# EAGLE design ShardV3 (EAGLE 7.3.0)
CNAME: EARS PocketQube Template; CREVISION: 1.0; DESIGNER: M. Isbell & L. Stant
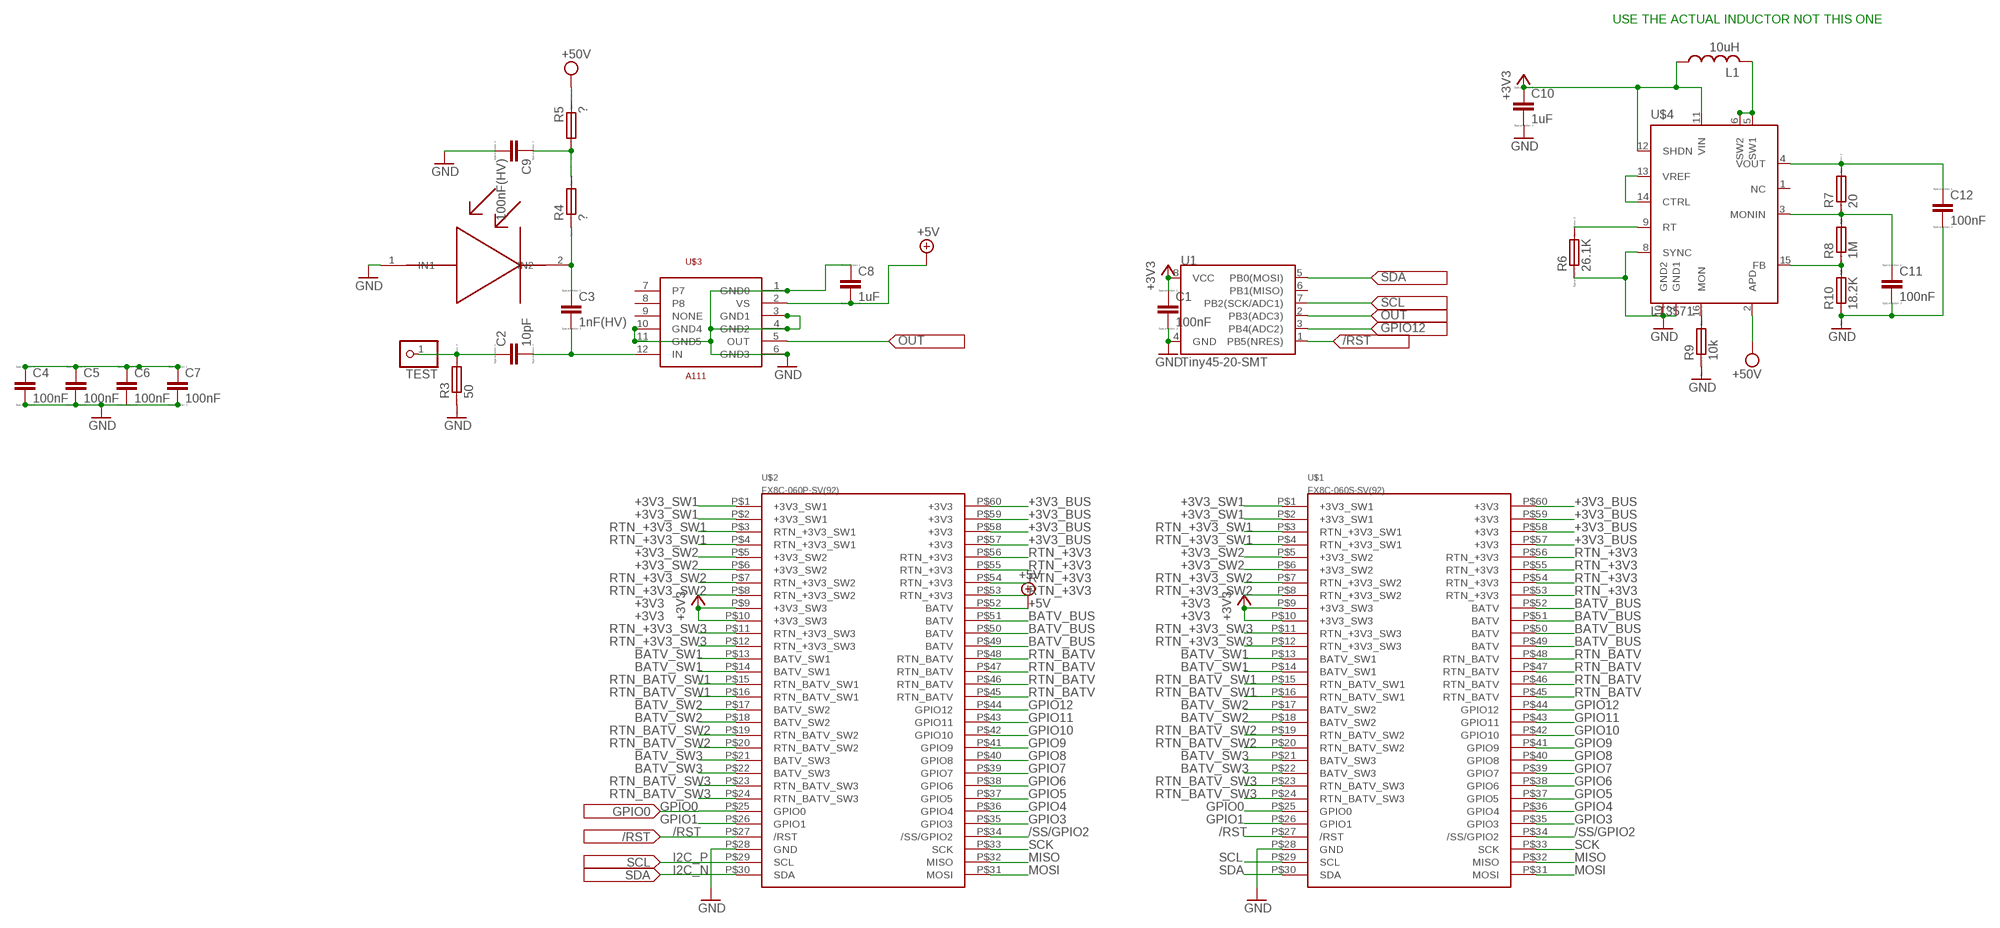
[diagram p0: schematic, sheet 1]

## Parts
C1  100nF  CC0402  [C0402]
C2  10pF  CC0402  [C0402]
C3  1nF(HV)  CC0603  [C0603]
C4  100nF  CC0402  [C0402]
C5  100nF  CC0402  [C0402]
C6  100nF  CC0402  [C0402]
C7  100nF  CC0402  [C0402]
C8  1uF  CC0603  [C0603]
C9  100nF(HV)  CC0603  [C0603]
C10  1uF  CC0603  [C0603]
C11  100nF  CC0603  [C0603]
C12  100nF  CC0603  [C0603]
L1  10uH  L-USL1812  [L1812]
NDD  S3590-08  [S3590-08]
R3  50  RR0402  [R0402]
R4  ?  RR0402  [R0402]
R5  ?  RR0402  [R0402]
R6  26.1K  RR0402  [R0402]
R7  20  RR0402  [R0402]
R8  1M  RR0402  [R0402]
R9  10k  RR0402  [R0402]
R10  18.2K  RR0402  [R0402]
TEST  PINHD-1X1  [1X01]
U1  Tiny45-20-SMT  ATTINY45TINY45-20-SMT  [SO08-EIAJ]
U$1  FX8C-060S-SV(92)  [FX8C-060S-SV(92)]
U$2  FX8C-060P-SV(92)  [FX8C-060P-SV(92)]
U$3  A111CHIP  [A111CHIP]
U$4  LT3571  [QFN3X3-6]

## Nets
+3V3: C1.1 C10.1 L1.1 U1.8(VCC) U$1.P$9(+3V3_SW3) U$1.P$10(+3V3_SW3) U$2.P$9(+3V3_SW3) U$2.P$10(+3V3_SW3) U$4.11(VIN) U$4.12(SHDN)
+3V3_BUS: U$1.P$57(+3V3) U$1.P$58(+3V3) U$1.P$59(+3V3) U$1.P$60(+3V3) U$2.P$57(+3V3) U$2.P$58(+3V3) U$2.P$59(+3V3) U$2.P$60(+3V3)
+3V3_SW1: U$1.P$1(+3V3_SW1) U$1.P$2(+3V3_SW1) U$2.P$1(+3V3_SW1) U$2.P$2(+3V3_SW1)
+3V3_SW2: U$1.P$5(+3V3_SW2) U$1.P$6(+3V3_SW2) U$2.P$5(+3V3_SW2) U$2.P$6(+3V3_SW2)
+5V: C8.2 U$2.P$52(BATV) U$3.2(VS)
/RST: U1.1(PB5(NRES)) U$1.P$27(/RST) U$2.P$27(/RST)
/SS/GPIO2: U$1.P$34(/SS/GPIO2) U$2.P$34(/SS/GPIO2)
BATV_BUS: U$1.P$49(BATV) U$1.P$50(BATV) U$1.P$51(BATV) U$1.P$52(BATV) U$2.P$49(BATV) U$2.P$50(BATV) U$2.P$51(BATV)
BATV_SW1: U$1.P$13(BATV_SW1) U$1.P$14(BATV_SW1) U$2.P$13(BATV_SW1) U$2.P$14(BATV_SW1)
BATV_SW2: U$1.P$17(BATV_SW2) U$1.P$18(BATV_SW2) U$2.P$17(BATV_SW2) U$2.P$18(BATV_SW2)
BATV_SW3: U$1.P$21(BATV_SW3) U$1.P$22(BATV_SW3) U$2.P$21(BATV_SW3) U$2.P$22(BATV_SW3)
CHASSIS_GND: C4.1 C5.1 C6.1 C7.1
GND: C1.2 C4.2 C5.2 C7.2 C8.1 C9.2 C10.2 C11.2 C12.2 NDD.1(IN1) R3.1 R6.1 R9.1 R10.1 U1.4(GND) U$1.P$28(GND) U$2.P$28(GND) U$3.1(GND0) U$3.3(GND1) U$3.4(GND2) U$3.6(GND3) U$3.10(GND4) U$3.11(GND5) U$4.7(GND1) U$4.8(SYNC) U$4.10(GND2)
GPIO0: U$1.P$25(GPIO0) U$2.P$25(GPIO0)
GPIO1: U$1.P$26(GPIO1) U$2.P$26(GPIO1)
GPIO3: U$1.P$35(GPIO3) U$2.P$35(GPIO3)
GPIO4: U$1.P$36(GPIO4) U$2.P$36(GPIO4)
GPIO5: U$1.P$37(GPIO5) U$2.P$37(GPIO5)
GPIO6: U$1.P$38(GPIO6) U$2.P$38(GPIO6)
GPIO7: U$1.P$39(GPIO7) U$2.P$39(GPIO7)
GPIO8: U$1.P$40(GPIO8) U$2.P$40(GPIO8)
GPIO9: U$1.P$41(GPIO9) U$2.P$41(GPIO9)
GPIO10: U$1.P$42(GPIO10) U$2.P$42(GPIO10)
GPIO11: U$1.P$43(GPIO11) U$2.P$43(GPIO11)
GPIO12: U1.3(PB4(ADC2)) U$1.P$44(GPIO12) U$2.P$44(GPIO12)
I2C_N: U1.5(PB0(MOSI)) U$2.P$30(SDA)
I2C_P: U1.7(PB2(SCK/ADC1)) U$2.P$29(SCL)
MISO: U$1.P$32(MISO) U$2.P$32(MISO)
MOSI: U$1.P$31(MOSI) U$2.P$31(MOSI)
N$23: C2.1 R3.2 TEST.1
N$24: C2.2 C3.2 U$3.12(IN)
N$25: C3.1 NDD.2(IN2) R4.1
N$27: L1.2 U$4.5(SW1) U$4.6(SW2)
N$28: C9.1 R4.2 R5.2
N$29: U$4.13(VREF) U$4.14(CTRL)
N$31: R6.2 U$4.9(RT)
N$32: C11.1 R7.1 R8.2 U$4.3(MONIN)
N$33: C12.1 R7.2 U$4.4(VOUT)
N$34: R8.1 R10.2 U$4.15(FB)
N$35: R9.2 U$4.16(MON)
OUT: U1.2(PB3(ADC3)) U$3.5(OUT)
RTN_+3V3: U$1.P$53(RTN_+3V3) U$1.P$54(RTN_+3V3) U$1.P$55(RTN_+3V3) U$1.P$56(RTN_+3V3) U$2.P$53(RTN_+3V3) U$2.P$54(RTN_+3V3) U$2.P$55(RTN_+3V3) U$2.P$56(RTN_+3V3)
RTN_+3V3_SW1: U$1.P$3(RTN_+3V3_SW1) U$1.P$4(RTN_+3V3_SW1) U$2.P$3(RTN_+3V3_SW1) U$2.P$4(RTN_+3V3_SW1)
RTN_+3V3_SW2: U$1.P$7(RTN_+3V3_SW2) U$1.P$8(RTN_+3V3_SW2) U$2.P$7(RTN_+3V3_SW2) U$2.P$8(RTN_+3V3_SW2)
RTN_+3V3_SW3: U$1.P$11(RTN_+3V3_SW3) U$1.P$12(RTN_+3V3_SW3) U$2.P$11(RTN_+3V3_SW3) U$2.P$12(RTN_+3V3_SW3)
RTN_BATV: U$1.P$45(RTN_BATV) U$1.P$46(RTN_BATV) U$1.P$47(RTN_BATV) U$1.P$48(RTN_BATV) U$2.P$45(RTN_BATV) U$2.P$46(RTN_BATV) U$2.P$47(RTN_BATV) U$2.P$48(RTN_BATV)
RTN_BATV_SW1: U$1.P$15(RTN_BATV_SW1) U$1.P$16(RTN_BATV_SW1) U$2.P$15(RTN_BATV_SW1) U$2.P$16(RTN_BATV_SW1)
RTN_BATV_SW2: U$1.P$19(RTN_BATV_SW2) U$1.P$20(RTN_BATV_SW2) U$2.P$19(RTN_BATV_SW2) U$2.P$20(RTN_BATV_SW2)
RTN_BATV_SW3: U$1.P$23(RTN_BATV_SW3) U$1.P$24(RTN_BATV_SW3) U$2.P$23(RTN_BATV_SW3) U$2.P$24(RTN_BATV_SW3)
SCK: U$1.P$33(SCK) U$2.P$33(SCK)
SCL: U$1.P$29(SCL)
SDA: U$1.P$30(SDA)
VPP: R5.1 U$4.2(APD) ; supply symbol labelled +50V
Unconnected: C6.2 U1.6(PB1(MISO)) U$3.7 U$3.8 U$3.9(NONE) U$4.1(NC)

## Notes on the sheet
- USE THE ACTUAL INDUCTOR NOT THIS ONE

## Library data of the parts
C1-C12 = eagle-ltspice:C: CAPACITOR, European symbol; SPICEMODEL: NONE; SPICEPREFIX: C
L1 = rcl:L-US: INDUCTOR, American symbol
NDD = SHARD-1:S3590-08
R3-R10 = eagle-ltspice:R: RESISTOR, European symbol; SPICEMODEL: NONE; SPICEPREFIX: R
TEST = pinhead:PINHD-1X1: PIN HEADER
U1 = sparkfundigitalic:ATTINY45: Atmel 8-pin 2/4/8kB flash uC; PROD_ID: IC-08922
U$1 = Template:FX8C-060S-SV(92)
U$2 = Template:FX8C-060P-SV(92)
U$3 = SHARD-1:A111CHIP: Package for A111 chip
U$4 = linear-technology:LT3571

## Board
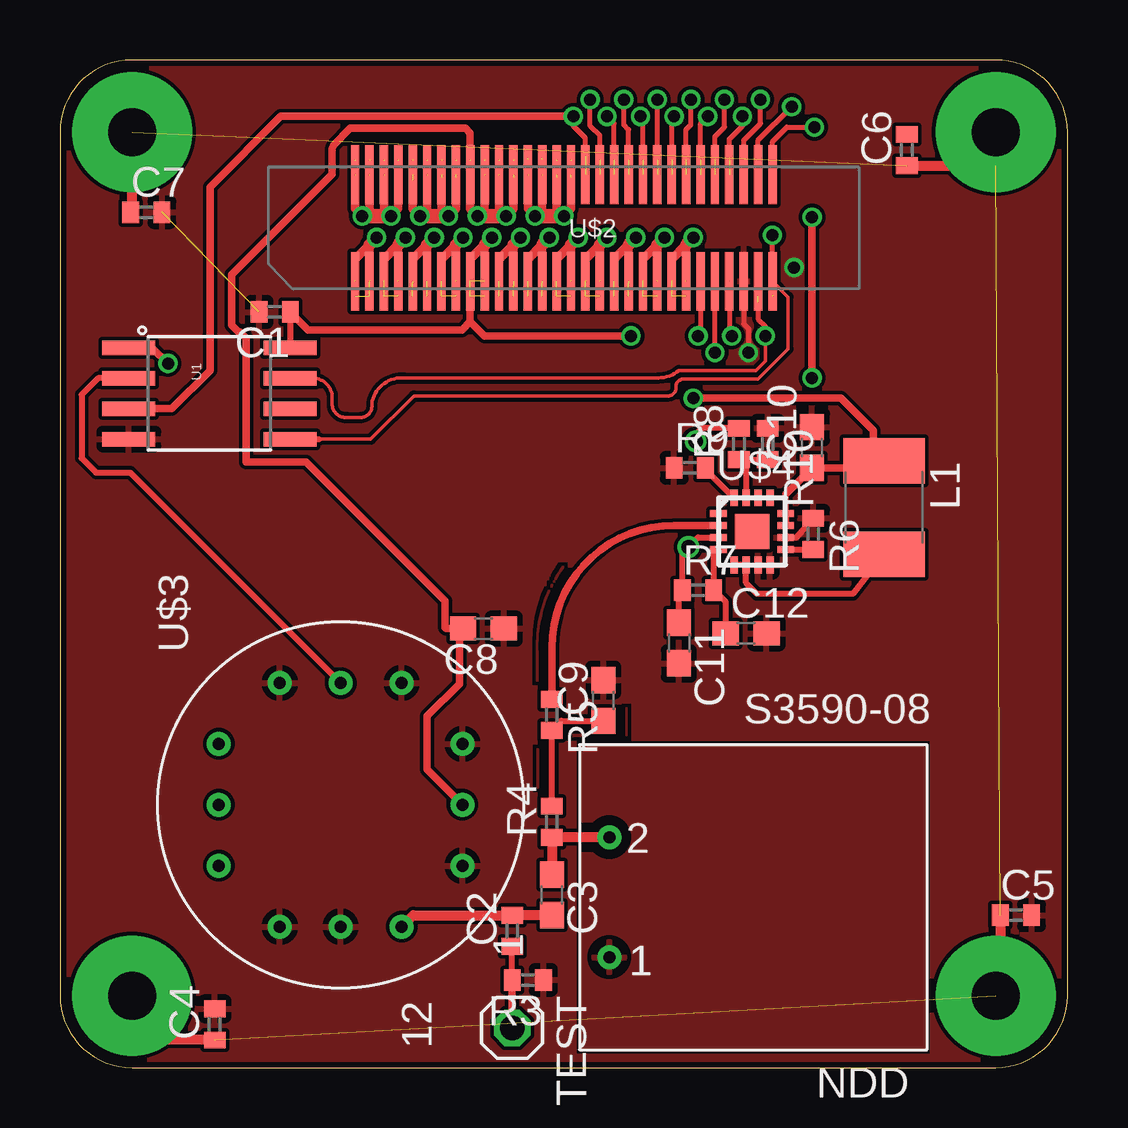
[diagram p1: board, top side]
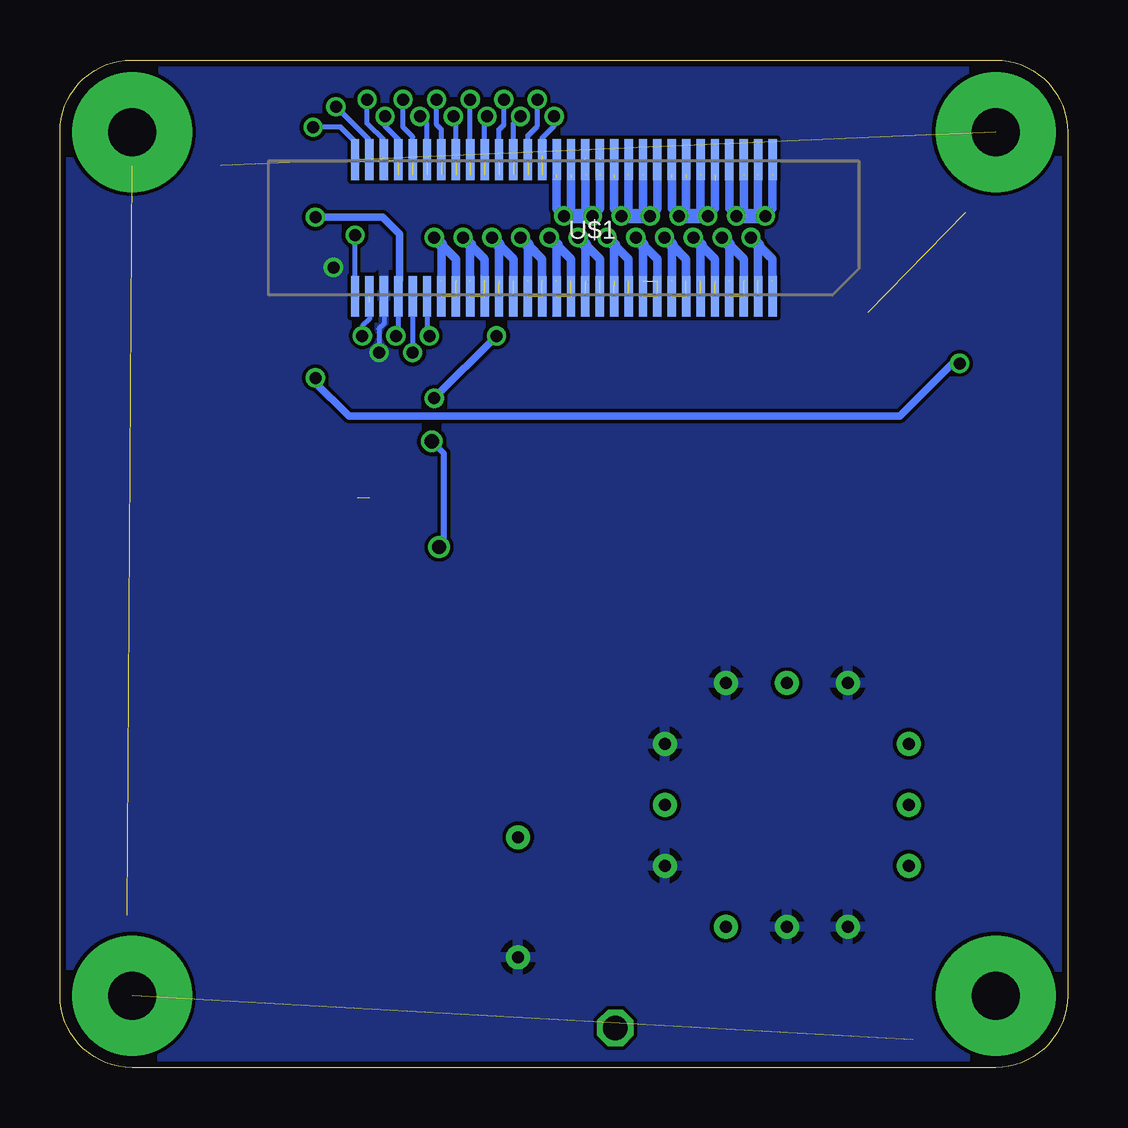
[diagram p2: board, bottom side, seen from below]

Size 42 x 42 mm. Coordinates in mm from the lower left corner, seen from the top.
Outline: 3,0 39,0 arc90 42,3 42,39 arc90 39,42 3,42 arc90 0,39 0,3 arc90 3,0
Copper layers (1*16): Top 0.035mm / dielectric 1.5mm / Bottom 0.035mm
Design rules "SeeedStudio_2layer_DRU_no_angle_20140221 *": minimum track width 6mil, minimum drill 0.5mm, track to track 6mil, track to pad 6mil, pad to pad 6mil, via to via 6mil, smd to smd 0mil, copper to edge 10mil, drill to drill 10mil, minimum pad ring 10mil, minimum via ring 6mil, stop-mask expansion 2mil, vias tented up to drill 100mil, thermal gap 10mil

### Footprints (pad centres in the part's own frame; a part is rotated, then mirrored left to right if it is on the bottom)
C0402 = smd 0.7 x 0.9: 1 -0.65,0; 2 0.65,0
C0603 = smd 1.1 x 1: 1 -0.85,0; 2 0.85,0
L1812 = smd 1.9 x 3.4: 1 -1.95,0; 2 1.95,0
S3590-08 = drill 0.5: 1 6,2.5; 2 6,-2.5
R0402 = smd 0.7 x 0.9: 1 -0.65,0; 2 0.65,0
1X01 = drill 1.016 octagon: 1 0,0
SO08-EIAJ = smd 0.61 x 2.21: 1 -1.905,-3.378; 2 -0.635,-3.378; 3 0.635,-3.378; 4 1.905,-3.378; 5 1.905,3.353; 6 0.635,3.353; 7 -0.635,3.353; 8 -1.905,3.353
FX8C-060S-SV(92) = smd 0.35 x 1.7: P$1 -8.7,2.85; P$2 -8.1,2.85; P$3 -7.5,2.85; P$4 -6.9,2.85; P$5 -6.3,2.85; P$6 -5.7,2.85; P$7 -5.1,2.85; P$8 -4.5,2.85; P$9 -3.9,2.85; P$10 -3.3,2.85; P$11 -2.7,2.85; P$12 -2.1,2.85; P$13 -1.5,2.85; P$14 -0.9,2.85; P$15 -0.3,2.85; P$16 0.3,2.85; P$17 0.9,2.85; P$18 1.5,2.85; P$19 2.1,2.85; P$20 2.7,2.85; P$21 3.3,2.85; P$22 3.9,2.85; P$23 4.5,2.85; P$24 5.1,2.85; P$25 5.7,2.85; P$26 6.3,2.85; P$27 6.9,2.85; P$28 7.5,2.85; P$29 8.1,2.85; P$30 8.7,2.85; P$31 8.7,-2.85; P$32 8.1,-2.85; P$33 7.5,-2.85; P$34 6.9,-2.85; P$35 6.3,-2.85; P$36 5.7,-2.85; P$37 5.1,-2.85; P$38 4.5,-2.85; P$39 3.9,-2.85; P$40 3.3,-2.85; P$41 2.7,-2.85; P$42 2.1,-2.85; P$43 1.5,-2.85; P$44 0.9,-2.85; P$45 0.3,-2.85; P$46 -0.3,-2.85; P$47 -0.9,-2.85; P$48 -1.5,-2.85; P$49 -2.1,-2.85; P$50 -2.7,-2.85; P$51 -3.3,-2.85; P$52 -3.9,-2.85; P$53 -4.5,-2.85; P$54 -5.1,-2.85; P$55 -5.7,-2.85; P$56 -6.3,-2.85; P$57 -6.9,-2.85; P$58 -7.5,-2.85; P$59 -8.1,-2.85; P$60 -8.7,-2.85
FX8C-060P-SV(92) = smd 0.35 x 2.45: P$1 -8.7,-2.225; P$2 -8.1,-2.225; P$3 -7.5,-2.225; P$4 -6.9,-2.225; P$5 -6.3,-2.225; P$6 -5.7,-2.225; P$7 -5.1,-2.225; P$8 -4.5,-2.225; P$9 -3.9,-2.225; P$10 -3.3,-2.225; P$11 -2.7,-2.225; P$12 -2.1,-2.225; P$13 -1.5,-2.225; P$14 -0.9,-2.225; P$15 -0.3,-2.225; P$16 0.3,-2.225; P$17 0.9,-2.225; P$18 1.5,-2.225; P$19 2.1,-2.225; P$20 2.7,-2.225; P$21 3.3,-2.225; P$22 3.9,-2.225; P$23 4.5,-2.225; P$24 5.1,-2.225; P$25 5.7,-2.225; P$26 6.3,-2.225; P$27 6.9,-2.225; P$28 7.5,-2.225; P$29 8.1,-2.225; P$30 8.7,-2.225; P$31 8.7,2.225; P$32 8.1,2.225; P$33 7.5,2.225; P$34 6.9,2.225; P$35 6.3,2.225; P$36 5.7,2.225; P$37 5.1,2.225; P$38 4.5,2.225; P$39 3.9,2.225; P$40 3.3,2.225; P$41 2.7,2.225; P$42 2.1,2.225; P$43 1.5,2.225; P$44 0.9,2.225; P$45 0.3,2.225; P$46 -0.3,2.225; P$47 -0.9,2.225; P$48 -1.5,2.225; P$49 -2.1,2.225; P$50 -2.7,2.225; P$51 -3.3,2.225; P$52 -3.9,2.225; P$53 -4.5,2.225; P$54 -5.1,2.225; P$55 -5.7,2.225; P$56 -6.3,2.225; P$57 -6.9,2.225; P$58 -7.5,2.225; P$59 -8.1,2.225; P$60 -8.7,2.225
A111CHIP = drill 0.5: 1 -2.54,-5.08; 2 0,-5.08; 3 2.54,-5.08; 4 5.08,-2.54; 5 5.08,0; 6 5.08,2.54; 7 2.54,5.08; 8 0,5.08; 9 -2.54,5.08; 10 -5.08,2.54; 11 -5.08,0; 12 -5.08,-2.54
QFN3X3-6 = smd 0.7 x 0.3: 1 -1.4,0.75; 2 -1.4,0.25; 3 -1.4,-0.25; 4 -1.4,-0.75; 9 1.4,-0.75; 10 1.4,-0.25; 11 1.4,0.25; 12 1.4,0.75 | smd 0.3 x 0.7: 5 -0.75,-1.4; 6 -0.25,-1.4; 7 0.25,-1.4; 8 0.75,-1.4; 13 0.75,1.4; 14 0.25,1.4; 15 -0.25,1.4; 16 -0.75,1.4 | smd 1.45 x 1.45: EXP 0,0

### Placement (x,y rotation side)
C1  8.95,31.5 180 top
C2  18.85,5.7 90 top
C3  20.5,7.2 270 top
C4  6.45,1.8 90 top
C5  39.85,6.35 0 top
C6  35.3,38.25 90 top
C7  3.6,35.65 0 top
C8  17.65,18.3 180 top
C9  22.65,15.3 90 top
C10  31.35,25.85 90 top
C11  25.8,17.7 270 top
C12  28.6,18.1 0 top
L1  34.35,23.35 270 top
NDD  28.9,7.1 180 top
R3  19.5,3.65 180 top
R4  20.5,10.25 90 top
R5  20.5,14.7 270 top
R6  31.4,22.25 270 top
R7  26.6,19.9 0 top
R8  28.3,26 90 top
R9  26.25,25 0 top
R10  29.5,26 270 top
TEST  18.85,1.65 270 top
U1  6.25,28.1 270 top
U$1  21,35 180 bottom
U$2  21,35 0 top
U$3  11.7,10.95 90 top
U$4  28.85,22.35 0 top
U$5  [EARSLOGOFULL]  -14.35,23.1 0 bottom  (outside the outline)

### Tracks (layer width: path | path; a pad name or v marks a point on that pad's centre or on a via)
+3V3  (via drill 0.5)  (4 unrouted)
  Top 0.254: C1.1 U1.8 | L1.1 34.05,25 C10.1 30.25,23.9 U$4.12 U$4.11
  Top 0.305: 30.25,23.9 31.3,24.95 31.45,24.95 31.5,25 34.25,25 | C1.1 10.35,30.75 16.75,30.75 17.1,31.1 | 17.1,31.1 U$1.P$9 | 17.1,31.1 17.7,30.5 v23.8,30.5 | v26.4,27.9 32.55,27.9 33.9,26.55 33.9,25.75 L1.1
  Bottom 0.305: v23.8,30.5 v26.4,27.9
+3V3_BUS  (via drill 0.5)  (7 unrouted)
  Top 0.35: U$2.P$57 14.1,35.8 v13.8,35.5 13.5,35.8 13.5,37.2 | 12.9,37.2 12.9,35.8 v12.6,35.5 12.3,35.8 12.3,37.2
  Top 0.6: v12.6,35.5 v13.8,35.5
  Bottom 0.35: 12.3,37.8 12.3,35.8 v12.6,35.5 12.9,35.8 12.9,37.8 | 13.5,37.8 13.5,35.8 v13.8,35.5 14.1,35.8 14.1,37.8
  Bottom 0.6: v12.6,35.5 v13.8,35.5
+3V3_SW1  (via drill 0.5)  (4 unrouted)
  Top 0.35: 12.9,33.8 12.9,34.3 12.3,33.7 12.3,32.8
  Top 0.5: 12.9,34.3 v13.2,34.6
  Bottom 0.35: 12.9,32.8 12.9,34.3 12.3,33.7 12.3,32.8
  Bottom 0.5: 12.9,34.3 v13.2,34.6
+3V3_SW2  (via drill 0.5)  (4 unrouted)
  Top 0.35: 15.3,33.8 15.3,34.3 14.7,33.7
  Top 0.5: 15.3,34.3 v15.6,34.6
  Bottom 0.35: 15.3,32.7 15.3,34.3 14.7,33.7 14.7,32.7
  Bottom 0.5: v15.6,34.6 15.3,34.3
+3V3_SW3  (via drill 0.5)
  Top 0.35: 17.7,33.8 17.7,34.3 17.1,33.7
  Top 0.5: 17.7,34.3 v18,34.6
  Bottom 0.35: 17.7,32.8 17.7,34.3 17.1,33.7 17.1,32.8
  Bottom 0.5: v18,34.6 17.7,34.3
+5V
  Top 0.305: U$2.P$52 17.1,38.95 16.9,39.15 12.1,39.15 11.4,38.45 11.35,38.3 11.35,37.25 7.15,33.05 7.15,30.95 7.45,30.65 7.5,30.65 7.75,30.4 7.75,25.25 10.25,25.25 16.05,19.45 16.05,18.35 16.1,18.3 C8.2 16.65,18.15 16.65,16 15.3,14.65 15.3,12.43 U$3.2
/RST  (via drill 0.5)  (1 unrouted)
  Top 0.17: 27.9,30.6 v28,30.5
  Top 0.2: U$2.P$27 27.9,30.6
  Top 0.305: v4.5,29.35 3.85,30 2.9,30 U1.1 | v31.35,28.75 v31.35,35.45
  Bottom 0.17: 27.9,30.6 v28,30.5 28.05,30.45
  Bottom 0.2: U$1.P$27 27.9,30.6
  Bottom 0.305: v31.35,28.75 31.4,28.6 29.95,27.15 7,27.15 4.8,29.35 v4.5,29.35 | v31.35,35.45 28.55,35.45 27.85,34.75 27.85,32.83 U$2.P$27
/SS/GPIO2  (via drill 0.5)  (1 unrouted)
  Top 0.2: 27.9,38.2 27.9,38.7 28.45,39.25 v28.45,39.65
  Bottom 0.2: U$1.P$34 27.9,38.7 28.45,39.25 v28.45,39.65
BATV_BUS  (via drill 0.5)  (7 unrouted)
  Top 0.35: 17.1,37.2 17.1,35.8 v17.4,35.5 17.7,35.8 17.7,37.2 | 18.3,37.2 18.3,35.8 v18.6,35.5 18.9,35.8 18.9,37.1
  Top 0.6: v17.4,35.5 v18.6,35.5
  Bottom 0.35: 17.1,37.8 17.1,35.8 v17.4,35.5 17.7,35.8 17.7,37.8 | 18.3,37.8 18.3,35.8 v18.6,35.5 18.9,35.8 18.9,37.8
  Bottom 0.6: v17.4,35.5 v18.6,35.5
BATV_SW1  (via drill 0.5)  (4 unrouted)
  Top 0.35: 20.1,33.8 20.1,34.3 19.5,33.7
  Top 0.5: v20.4,34.6 20.1,34.3
  Bottom 0.35: 20.1,32.7 20.1,34.3 19.5,33.7 19.5,32.6
  Bottom 0.5: v20.4,34.6 20.1,34.3
BATV_SW2  (via drill 0.5)  (4 unrouted)
  Top 0.35: 22.5,33.8 22.5,34.3 21.9,33.7
  Top 0.5: v22.8,34.6 22.5,34.3
  Bottom 0.35: 22.5,32.8 22.5,34.3 21.9,33.7 21.9,32.8
  Bottom 0.5: v22.8,34.6 22.5,34.3
BATV_SW3  (via drill 0.5)  (4 unrouted)
  Top 0.35: 24.9,33.9 24.9,34.3 24.3,33.7
  Top 0.5: v25.2,34.6 24.9,34.3
  Bottom 0.35: 24.9,32.8 24.9,34.3 24.3,33.7 24.3,32.8
  Bottom 0.5: v25.2,34.6 24.9,34.3
CHASSIS_GND  (via drill 2 pad 5)  (3 unrouted)
  Top 0.406: C5.1 39.2,4.2 39,4.2 v39,3 | C6.1 39,37.6 v39,39 | C7.1 3,35.65 v3,39 | C4.1 3,1.15 v3,3
GND  (via drill 0.5)  (1 unrouted)
  Top 0.2: U$2.P$28 28.5,31 28.7,30.8 v28.7,29.8
  Top 0.254: U$4.10 30.7,22.1 R6.1
  Bottom 0.2: U$1.P$28 28.5,31 28.7,30.8 v28.7,29.8
  other vias: 30.6,33.35
  pour Top (rank 2): 0,42 42,42 42,0 0,0
  pour Bottom: 0,42 42,42 42,0 0,0
GPIO0  (via drill 0.5)
  Top 0.2: U$2.P$25 26.7,30.6 v26.6,30.5
  Bottom 0.17: 26.65,30.45 v26.6,30.5
  Bottom 0.2: U$1.P$25 26.7,30.6 v26.6,30.5
GPIO1  (via drill 0.5)
  Top 0.2: v27.3,29.8 U$2.P$26
  Bottom 0.2: U$1.P$26 v27.3,29.8
GPIO3  (via drill 0.5)  (1 unrouted)
  Top 0.2: 27.3,38.1 27.3,38.8 27.7,39.2 v27.7,40.35
  Bottom 0.2: U$1.P$35 27.3,38.8 27.7,39.2 v27.7,40.35
GPIO4  (via drill 0.5)  (1 unrouted)
  Top 0.2: 26.7,38.1 26.7,39.35 v27,39.65
  Bottom 0.2: U$1.P$36 26.7,39.35 v27,39.65
GPIO5  (via drill 0.5)  (1 unrouted)
  Top 0.2: 26.1,38.2 26.1,39.1 26.3,39.3 v26.3,40.35
  Bottom 0.2: U$1.P$37 26.1,39.1 26.3,39.3 v26.3,40.35
GPIO6  (via drill 0.5)  (1 unrouted)
  Top 0.2: 25.5,38.2 25.5,39.55 v25.6,39.65
  Bottom 0.2: U$1.P$38 25.5,39.55 v25.6,39.65
GPIO7  (via drill 0.5)  (1 unrouted)
  Top 0.2: 24.9,38.2 v24.9,40.35
  Bottom 0.2: U$1.P$39 v24.9,40.35
GPIO8  (via drill 0.5)  (1 unrouted)
  Top 0.2: 24.3,38.1 24.3,39.55 v24.2,39.65
  Bottom 0.2: U$1.P$40 24.3,39.55 v24.2,39.65
GPIO9  (via drill 0.5)  (1 unrouted)
  Top 0.2: 23.7,38.3 23.7,39.1 23.5,39.3 v23.5,40.35
  Bottom 0.2: U$1.P$41 23.7,39.1 23.5,39.3 v23.5,40.35
GPIO10  (via drill 0.5)  (1 unrouted)
  Top 0.2: 23.1,38.1 23.1,39.35 v22.8,39.65
  Bottom 0.2: U$1.P$42 23.1,39.35 v22.8,39.65
GPIO11  (via drill 0.5)  (1 unrouted)
  Top 0.2: 22.5,38.3 22.5,38.85 22.1,39.25 v22.1,40.35
  Bottom 0.2: U$1.P$43 22.5,38.85 22.1,39.25 v22.1,40.35
GPIO12  (via drill 0.5)  (2 unrouted)
  Top 0.2: 21.9,38 21.9,38.75 21.4,39.25 v21.4,39.65
  Top 0.305: U1.3 4.67,27.46 6.25,29.05 6.25,36.7 9.2,39.65 v21.4,39.65
  Bottom 0.2: 21.9,38.45 21.9,38.75 21.4,39.25 v21.4,39.65
HV
  pour Top (isolate 0.406): 21.7,12.35 21.7,0.75 36.1,0.75 36.1,13.45 21.7,13.45
  pour Top (isolate 0.406): 20.95,6.95 21.05,17.7 arc-90 25.6,22.15 27.25,22.15 27.25,22.95 25.3,23 arc90 19.9,17.6 19.95,7
  pour Top (isolate 0.406): 20,15 23.6,15 23.6,13.85 20,13.85
I2C_N
  Top 0.152: U$2.P$30 30.35,32.12 30.35,29.95 29.1,28.7 26,28.7 arc90 25.67,28.37 arc-90 25.39,28 14.76,28 12.96,26.2 10.78,26.2
  Top 0.254: U1.5 10.78,26.2
I2C_P
  Top 0.152: U$2.P$29 29.1,31.2 29.4,30.9 29.4,29.45 29,29.05 25.8,29.05 arc-39 24.95,28.75 14.36,28.75 14.37,28.73 arc90 13,27.66 13,27.55 arc-90 12.55,27.1 11.95,27.1 arc-90 11.35,27.6 11.35,28 arc90 10.41,28.73 U1.7
MISO  (via drill 0.5)
  Top 0.2: U$2.P$32 29.1,38.65 v30.5,40.05
  Bottom 0.2: U$1.P$32 29.1,38.65 v30.5,40.05
MOSI  (via drill 0.5)
  Top 0.2: U$2.P$31 29.7,38.6 30.3,39.2 v31.45,39.2
  Bottom 0.2: U$1.P$31 29.7,38.6 30.3,39.2 v31.45,39.2
N$23
  Top 0.254: R3.2 C2.1
  Top 0.305: TEST.1 R3.2
N$24
  Top 0.406: C3.2 C2.2 14.72,6.35 U$3.12
N$25
  Top 0.406: NDD.2 R4.1 C3.1
N$27
  Top 0.254: L1.2 33.05,19.75 29.05,19.75 28.6,20.2 U$4.6 U$4.5
N$28
  Top 0.254: R4.2 R5.2 20.9,14.45 C9.1
N$29  (1 unrouted)
N$31
  Top 0.254: U$4.9 R6.2
N$32  (via drill 0.6)
  Top 0.254: C11.1 25.8,19.75 R7.1 25.95,21.45 v26.2,21.7 | v26.2,21.7 26.6,22.1 U$4.3 | v26.5,26.1 26.5,26.4 26.75,26.65 R8.2 | v26.2,21.7 26.23,21.73
  Bottom 0.254: v26.2,21.7 26,21.95 26,25.6 v26.5,26.1
N$33
  Top 0.254: C12.1 27.75,19.4 R7.2 27.25,21.4 U$4.4
N$34
  Top 0.254: U$4.15 28.6,25.05 R8.1 R10.2
N$35
  Top 0.254: U$4.16 27.1,24.75 R9.2
OUT
  Top 0.254: U1.2 1.58,28.73 0.9,28.05 0.9,25.4 1.5,24.8 2.93,24.8 U$3.5
RTN_+3V3  (via drill 0.5)  (8 unrouted)
  Top 0.35: 14.7,37 14.7,35.8 v15,35.5 15.3,35.8 15.3,37.2 | 15.9,37.1 15.9,35.8 v16.2,35.5 16.5,35.8 16.5,37.1
  Top 0.6: v15,35.5 v16.2,35.5
  Bottom 0.35: 14.7,37.8 14.7,35.8 v15,35.5 15.3,35.8 15.3,37.8 | 15.9,37.8 15.9,35.8 v16.2,35.5 16.5,35.8 16.5,37.8
  Bottom 0.6: v15,35.5 v16.2,35.5
RTN_+3V3_SW1  (via drill 0.5)  (4 unrouted)
  Top 0.35: 14.1,33.9 14.1,34.3 13.5,33.7
  Top 0.5: v14.4,34.6 14.1,34.3
  Bottom 0.35: 14.1,32.8 14.1,34.3 13.5,33.7 13.5,32.8
  Bottom 0.5: v14.4,34.6 14.1,34.3
RTN_+3V3_SW2  (via drill 0.5)  (4 unrouted)
  Top 0.35: 16.5,33.8 16.5,34.3 15.9,33.7
  Top 0.5: 16.5,34.3 v16.8,34.6
  Bottom 0.35: 16.5,32.8 16.5,34.3 15.9,33.7 15.9,32.7
  Bottom 0.5: v16.8,34.6 16.5,34.3
RTN_+3V3_SW3  (via drill 0.5)  (4 unrouted)
  Top 0.35: 18.9,33.8 18.9,34.3 18.3,33.7
  Top 0.5: v19.2,34.6 18.9,34.3
  Bottom 0.35: 18.9,32.6 18.9,34.3 18.3,33.7 18.3,32.7
  Bottom 0.5: v19.2,34.6 18.9,34.3
RTN_BATV  (via drill 0.5)  (8 unrouted)
  Top 0.35: 19.5,37.2 19.5,35.8 v19.8,35.5 20.1,35.8 20.1,37.2 | 20.7,37.1 20.7,35.8 v21,35.5 21.3,35.8 21.3,37.1
  Top 0.6: v19.8,35.5 v21,35.5
  Bottom 0.35: 19.5,37.9 19.5,35.8 v19.8,35.5 20.1,35.8 20.1,37.9 | 20.7,37.8 20.7,35.8 v21,35.5 21.3,35.8 21.3,37.8
  Bottom 0.6: v19.8,35.5 v21,35.5
RTN_BATV_SW1  (via drill 0.5)  (4 unrouted)
  Top 0.35: 21.3,33.9 21.3,34.3 20.7,33.7
  Top 0.5: v21.6,34.6 21.3,34.3
  Bottom 0.35: 21.3,32.8 21.3,34.3 20.7,33.7 20.7,32.7
  Bottom 0.5: v21.6,34.6 21.3,34.3
RTN_BATV_SW2  (via drill 0.5)  (4 unrouted)
  Top 0.35: 23.7,33.8 23.7,34.3 23.1,33.7
  Top 0.5: v24,34.6 23.7,34.3
  Bottom 0.35: 23.7,32.7 23.7,34.3 23.1,33.7 23.1,32.7
  Bottom 0.5: v24,34.6 23.7,34.3
RTN_BATV_SW3  (via drill 0.5)  (4 unrouted)
  Top 0.35: 26.1,33.8 26.1,34.3 25.5,33.7
  Top 0.5: v26.4,34.6 26.1,34.3
  Bottom 0.35: 26.1,32.8 26.1,34.3 25.5,33.7 25.5,32.8
  Bottom 0.5: v26.4,34.6 26.1,34.3
SCK  (via drill 0.5)
  Top 0.2: U$2.P$33 28.5,38.65 29.2,39.35 v29.2,40.35
  Bottom 0.2: U$1.P$33 28.5,38.65 29.2,39.35 v29.2,40.35
SCL  (via drill 0.5)  (1 unrouted)
  Top 0.2: 29.1,31.7 29.1,31.2 29.4,30.9 v29.4,30.5
  Bottom 0.2: 29.1,31.9 29.1,31.2 29.4,30.9 v29.4,30.5
SDA  (via drill 0.5)  (1 unrouted)
  Top 0.2: 29.7,33.35 v29.7,34.7
  Bottom 0.2: 29.7,32.2 v29.7,34.7
VPP
  Top 0.305: R5.1 20.5,17.5 arc-90 25.6,22.6 U$4.2